# EasyEDA schematic 1-Schematic_Meshtastic Lite.json
TITLE: Meshtastic; REV: 1.0; Date: 2021-06-15; Sheet: 1/1; Drawn By: spgsm; Company: Your Company
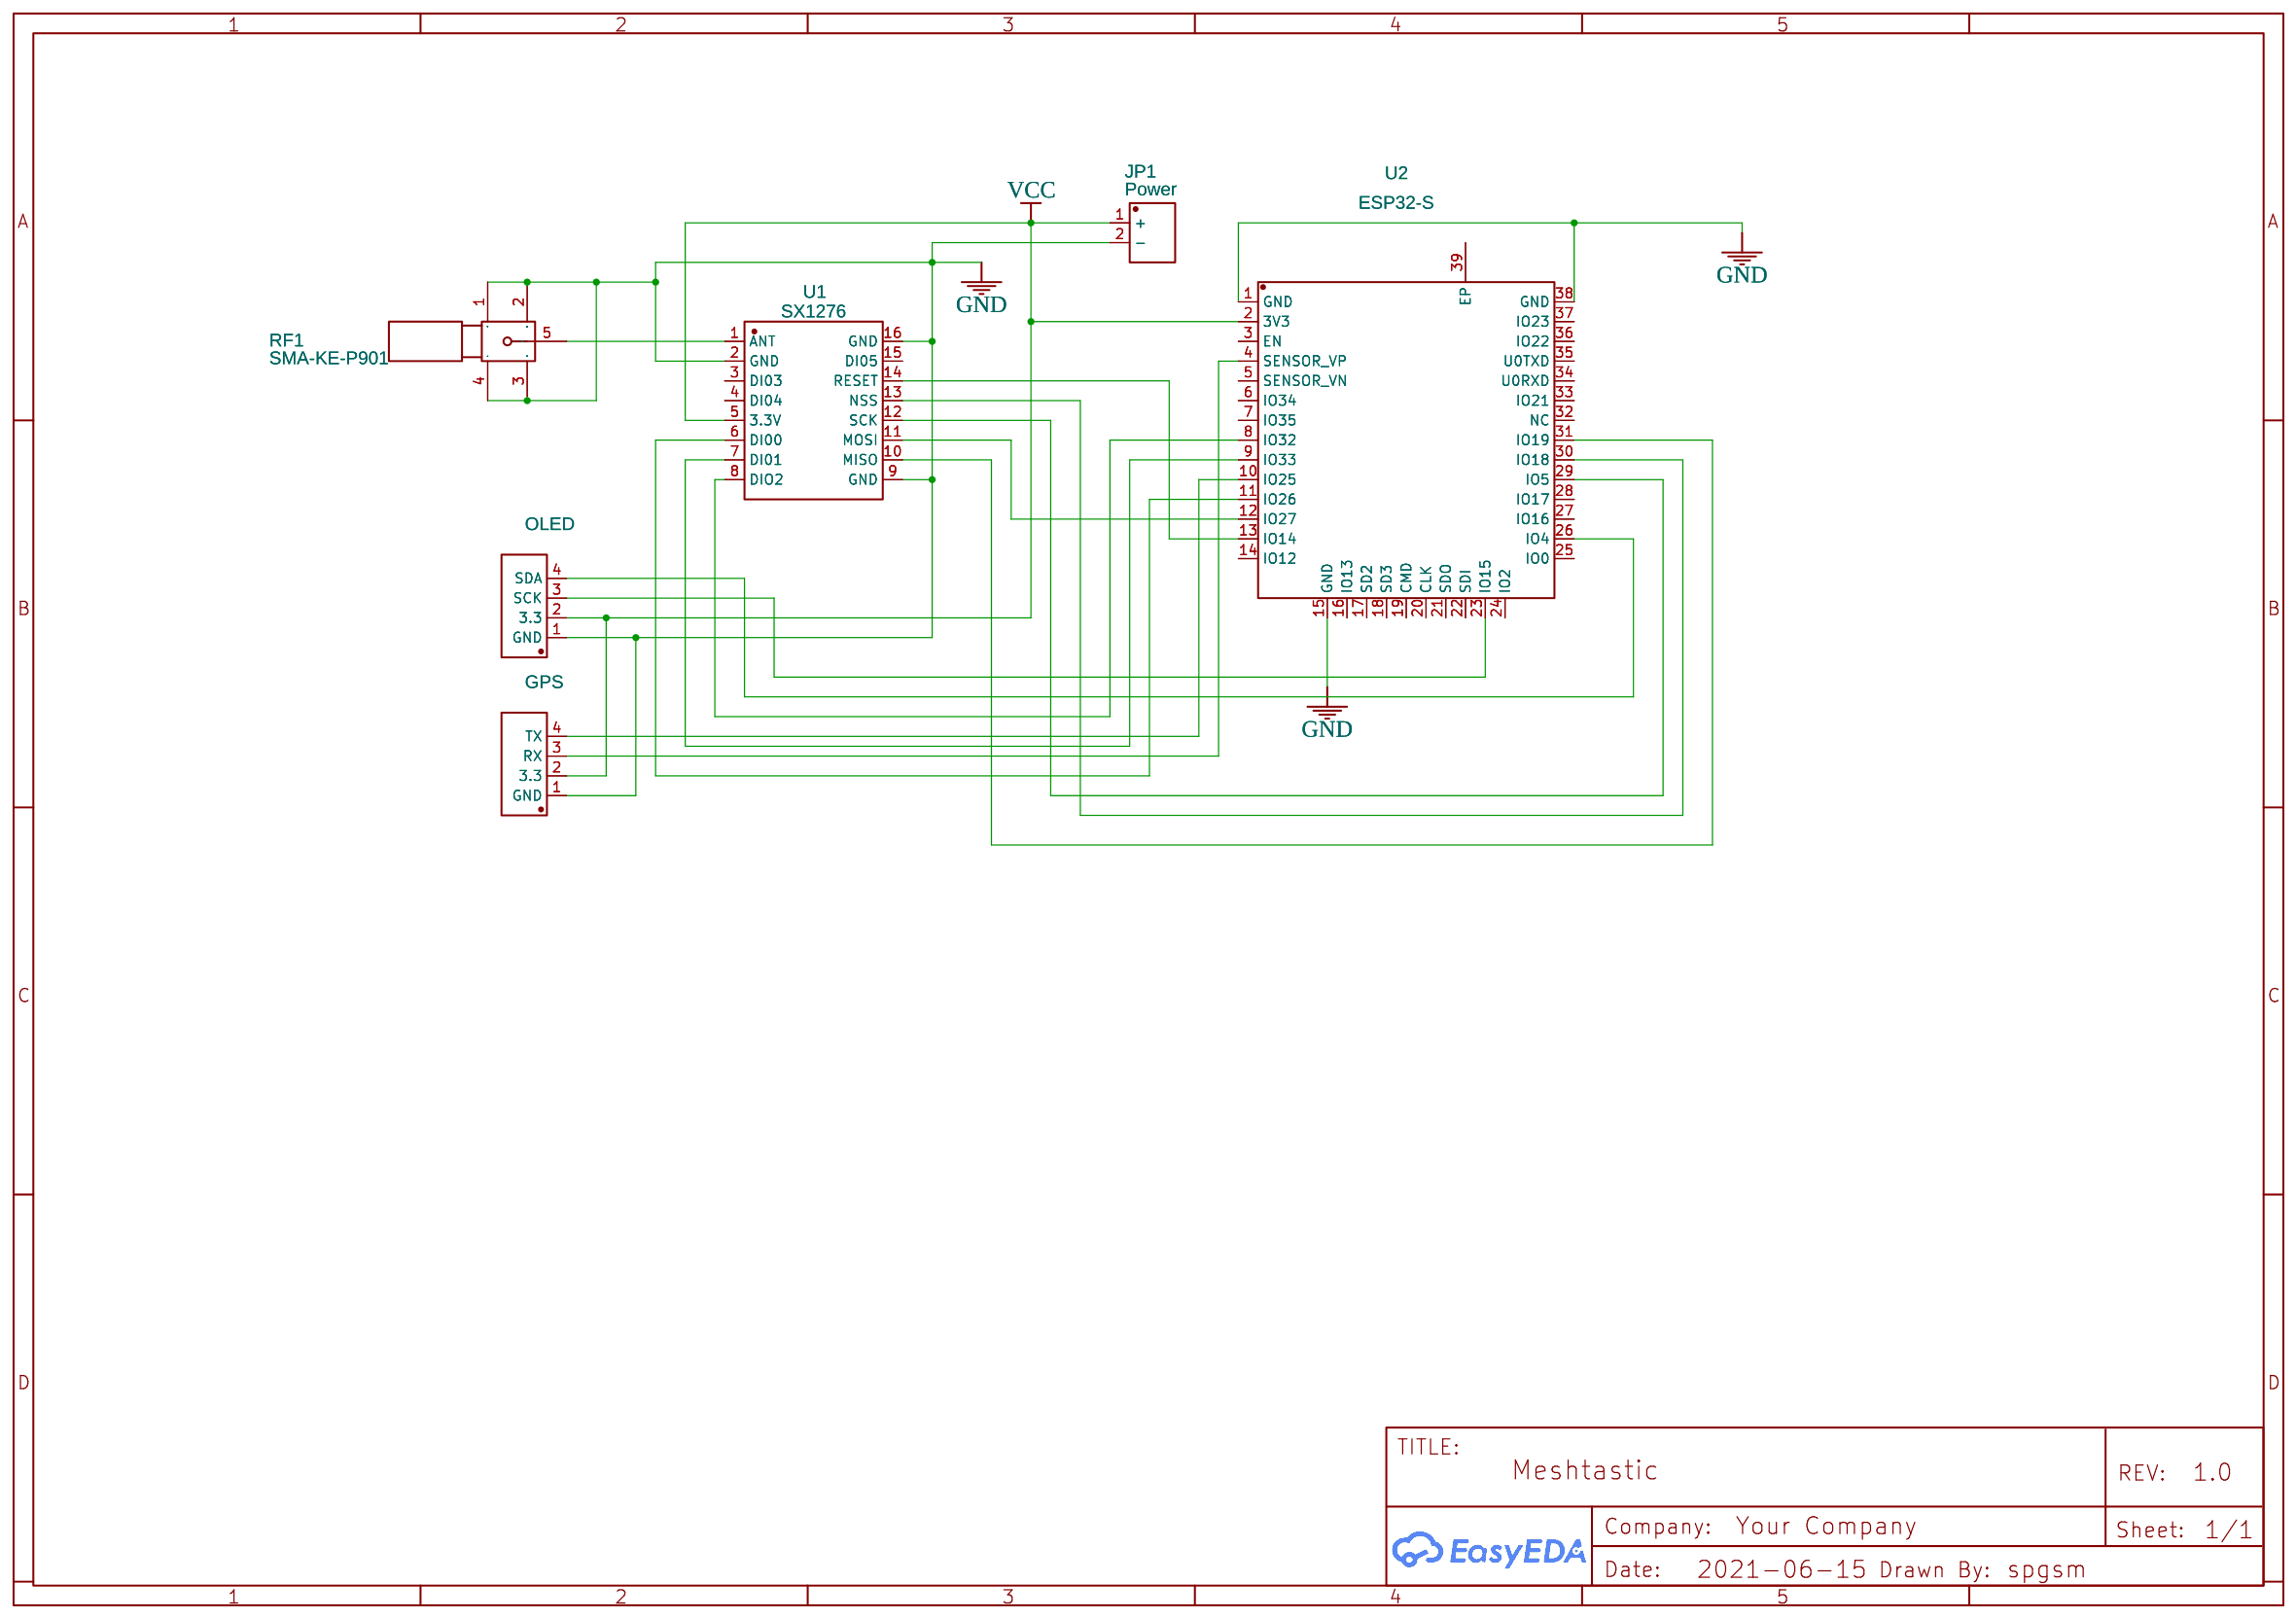
[diagram p0: schematic sheet]

## Parts
GPS  GPS  [CONN-TH_4P-P2.54_KF2510-4A]
JP1  Power  [1.25T-1-2A]
OLED  OLED  [CONN-TH_4P-P2.54_KF2510-4A]
RF1  SMA-KE-P901  [SMA-TH_SMA-KE-P901]
U1  SX1276  [WIRELM-SMD_SX1278S165SY-T-X1]
U2  ESP32-S  [WIRELM-SMD_ESP32-S]

## Library data of the parts
GPS OLED = KF2510-4A: Supplier Part: C27542; Supplier: LCSC; Manufacturer: ReliaPro
JP1 = 1.25T-1-2A_C2324: Supplier Part: C2324; Supplier: LCSC; Manufacturer: ReliaPro
RF1 = SMA-KE-P901: Supplier: LCSC; Supplier Part: C914556; Manufacturer: DreamLNK; Contributor: LCSC
U1 = SX1276S8S+T-X1: Supplier: LCSC; Supplier Part: C718834; Manufacturer: Vollgo; Contributor: LCSC
U2 = ESP32-S: Supplier: LCSC; Supplier Part: C277944; Manufacturer: Ai-Thinker; Contributor: LCSC; JLCPCB Part Class: Extended Part

## Nets
GND: GPS.1(GND) JP1.2(-) OLED.1(GND) RF1.1 RF1.2 RF1.3 RF1.4 U1.2(GND) U1.9(GND) U1.16(GND) U2.1(GND) U2.15(GND) U2.38(GND)
VCC: GPS.2(3.3) JP1.1(+) OLED.2(3.3) U1.5(3.3V) U2.2(3V3)
Net-(GPS-3): GPS.3(RX) U2.4(SENSOR_VP)
Net-(GPS-4): GPS.4(TX) U2.10(IO25)
Net-(OLED-3): OLED.3(SCK) U2.23(IO15)
Net-(OLED-4): OLED.4(SDA) U2.26(IO4)
Net-(RF1-5): RF1.5 U1.1(ANT)
Net-(U1-6): U1.6(DI00) U2.11(IO26)
Net-(U1-7): U1.7(DI01) U2.9(IO33)
Net-(U1-8): U1.8(DIO2) U2.8(IO32)
Net-(U1-10): U1.10(MISO) U2.31(IO19)
Net-(U1-11): U1.11(MOSI) U2.12(IO27)
Net-(U1-12): U1.12(SCK) U2.29(IO5)
Net-(U1-13): U1.13(NSS) U2.30(IO18)
Net-(U1-14): U1.14(RESET) U2.13(IO14)

Not connected (* = marked no-connect by the designer): U1 3(DI03) 4(DI04) 15(DI05); U2 3(EN) 5(SENSOR_VN) 6(IO34) 7(IO35) 14(IO12) 16(IO13) 17(SD2) 18(SD3) 19(CMD) 20(CLK) 21(SDO) 22(SDI) 24(IO2) 25(IO0) 27(IO16) 28(IO17) 32(NC) 33(IO21) 34(U0RXD) 35(U0TXD) 36(IO22) 37(IO23) 39(EP)
